# Altium project apt_battery_proj.PrjPCB
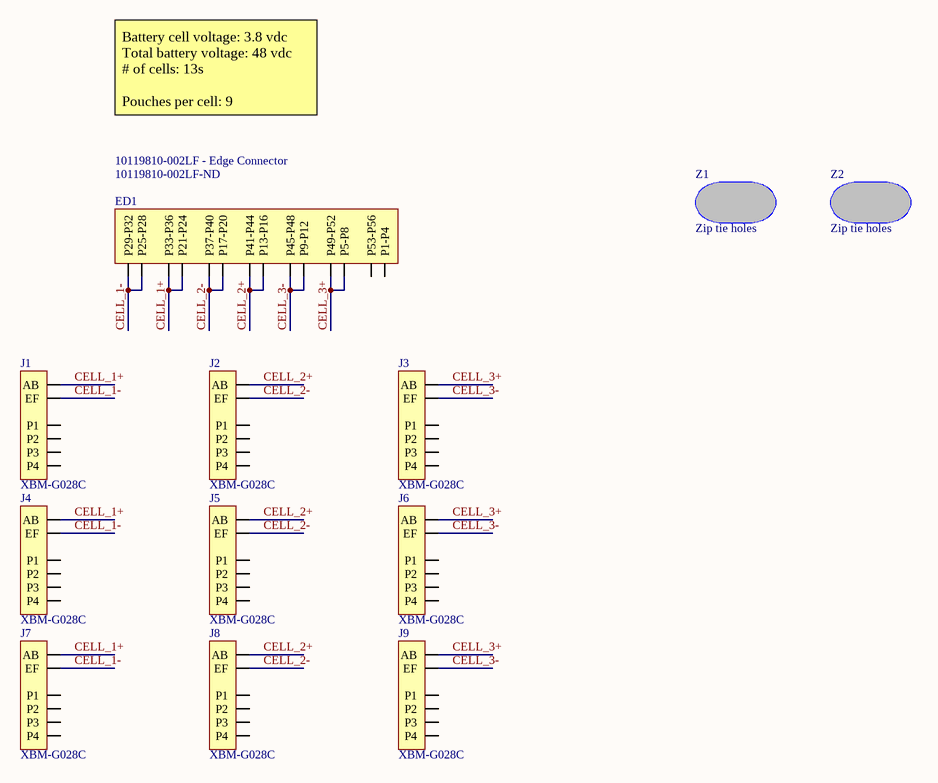
[diagram p0: battery_cell.SchDoc]
1 sheet, 12 parts. Net scope: global (net labels, ports and power ports of the same name join across sheets).
Board file: apt_battery_proj.PcbDoc

## Sheet battery_cell.SchDoc
size Tabloid

### Parts
ED1  10119810-002LF - Edge Connector  Supplier Part Number 1: 10119810-002LF-ND  [10119810-002LF - Edge Connector]
J1  XBM-G028C  [XBM-G028A]
J2  XBM-G028C  [XBM-G028A]
J3  XBM-G028C  [XBM-G028A]
J4  XBM-G028C  [XBM-G028A]
J5  XBM-G028C  [XBM-G028A]
J6  XBM-G028C  [XBM-G028A]
J7  XBM-G028C  [XBM-G028A]
J8  XBM-G028C  [XBM-G028A]
J9  XBM-G028C  [XBM-G028A]
Z1  Zip tie holes  [ZIP_TIE_HOLE]
Z2  Zip tie holes  [ZIP_TIE_HOLE]

### Nets
CELL_1+: ED1.P21-P24 ED1.P33-P36 J1.AB J4.AB J7.AB
CELL_1-: ED1.P25-P28 ED1.P29-P32 J1.EF J4.EF J7.EF
CELL_2+: ED1.P13-P16 ED1.P41-P44 J2.AB J5.AB J8.AB
CELL_2-: ED1.P17-P20 ED1.P37-P40 J2.EF J5.EF J8.EF
CELL_3+: ED1.P5-P8 ED1.P49-P52 J3.AB J6.AB J9.AB
CELL_3-: ED1.P9-P12 ED1.P45-P48 J3.EF J6.EF J9.EF

Not connected (* = marked no-connect by the designer): ED1 P1-P4 P53-P56; J1 P1 P2 P3 P4; J2 P1 P2 P3 P4; J3 P1 P2 P3 P4; J4 P1 P2 P3 P4; J5 P1 P2 P3 P4; J6 P1 P2 P3 P4; J7 P1 P2 P3 P4; J8 P1 P2 P3 P4; J9 P1 P2 P3 P4

### Notes on the sheet
- Battery cell voltage: 3.8 vdc
  Total battery voltage: 48 vdc
  # of cells: 13s
  Pouches per cell: 9

### Library data of the parts
J1-J9 = XBM-G028C: 28 pos power connector  (0.8X1.6mm pitch)-with post; Manufacturer: Neoconix; Manufacturer Part Number: XBM-G028C
Z1 Z2 = ZIP_TIE_HOLE
ED1 = 10119810-002LF - Edge Connector: Supplier 1: Digi-Key